# Altium schematic sheet LAN_RJ45.SchDoc
size B; SheetNumber: 4; SheetTotal: 4
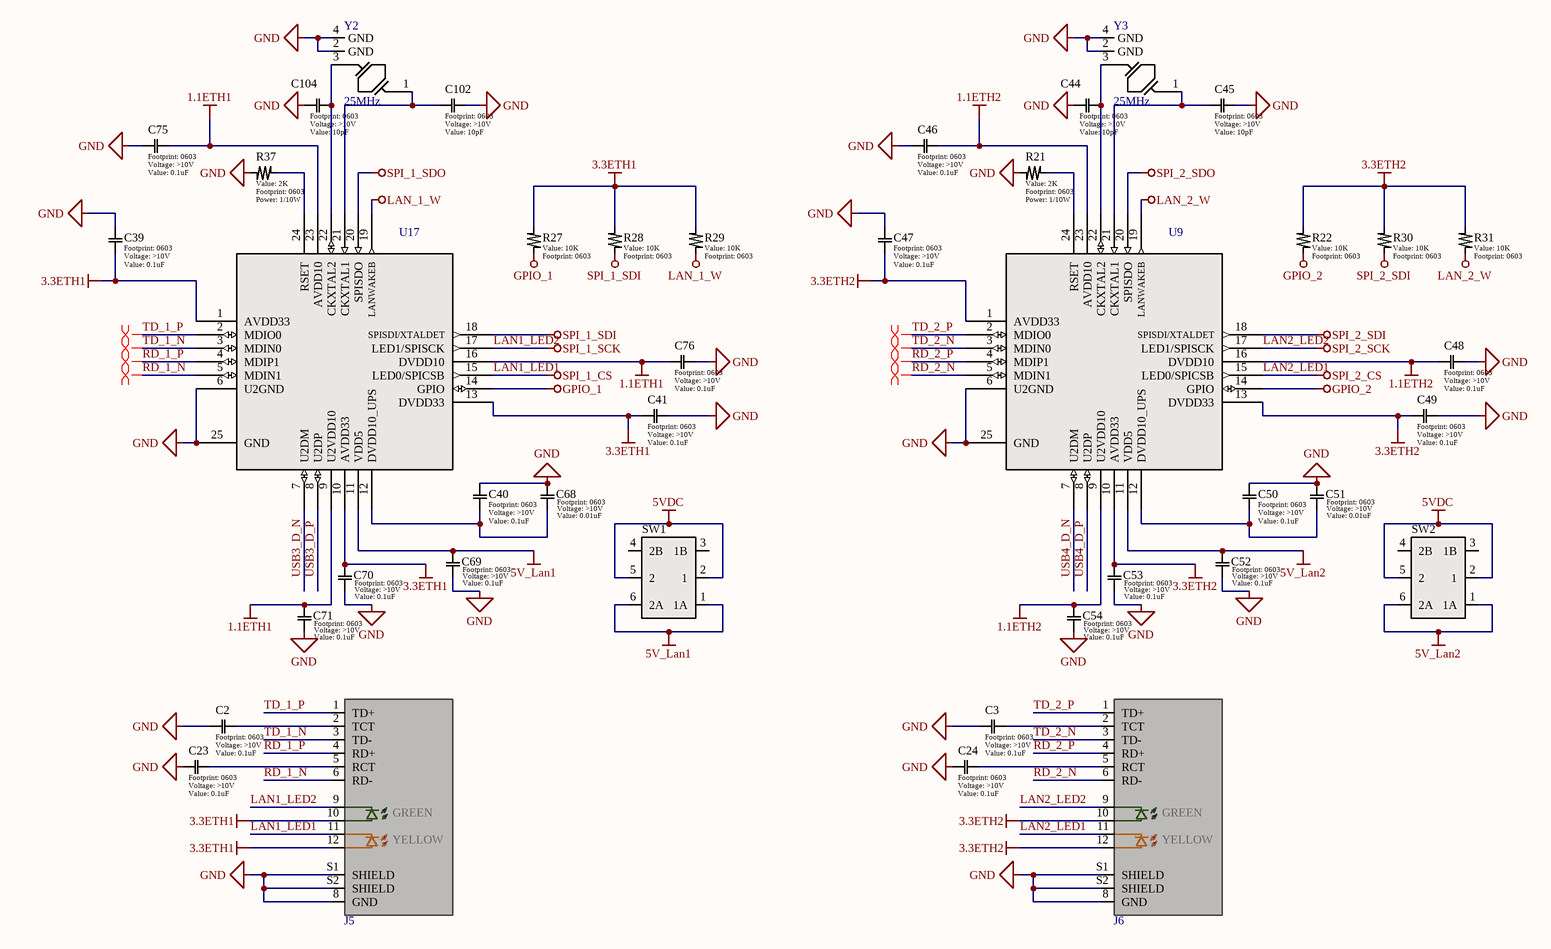
[diagram p0: LAN_RJ45.SchDoc]

## Parts
C2  value 0.1uF  Voltage: >10V  [0603]  (hidden comment: Generic Capacitor)
C3  value 0.1uF  Voltage: >10V  [0603]  (hidden comment: Generic Capacitor)
C23  value 0.1uF  Voltage: >10V  [0603]  (hidden comment: Generic Capacitor)
C24  value 0.1uF  Voltage: >10V  [0603]  (hidden comment: Generic Capacitor)
C39  value 0.1uF  Voltage: >10V  [0603]  (hidden comment: Generic Capacitor)
C40  value 0.1uF  Voltage: >10V  [0603]  (hidden comment: Generic Capacitor)
C41  value 0.1uF  Voltage: >10V  [0603]  (hidden comment: Generic Capacitor)
C44  value 10pF  Voltage: >10V  [0603]  (hidden comment: Generic Capacitor)
C45  value 10pF  Voltage: >10V  [0603]  (hidden comment: Generic Capacitor)
C46  value 0.1uF  Voltage: >10V  [0603]  (hidden comment: Generic Capacitor)
C47  value 0.1uF  Voltage: >10V  [0603]  (hidden comment: Generic Capacitor)
C48  value 0.1uF  Voltage: >10V  [0603]  (hidden comment: Generic Capacitor)
C49  value 0.1uF  Voltage: >10V  [0603]  (hidden comment: Generic Capacitor)
C50  value 0.1uF  Voltage: >10V  [0603]  (hidden comment: Generic Capacitor)
C51  value 0.01uF  Voltage: >10V  [0603]  (hidden comment: Generic Capacitor)
C52  value 0.1uF  Voltage: >10V  [0603]  (hidden comment: Generic Capacitor)
C53  value 0.1uF  Voltage: >10V  [0603]  (hidden comment: Generic Capacitor)
C54  value 0.1uF  Voltage: >10V  [0603]  (hidden comment: Generic Capacitor)
C68  value 0.01uF  Voltage: >10V  [0603]  (hidden comment: Generic Capacitor)
C69  value 0.1uF  Voltage: >10V  [0603]  (hidden comment: Generic Capacitor)
C70  value 0.1uF  Voltage: >10V  [0603]  (hidden comment: Generic Capacitor)
C71  value 0.1uF  Voltage: >10V  [0603]  (hidden comment: Generic Capacitor)
C75  value 0.1uF  Voltage: >10V  [0603]  (hidden comment: Generic Capacitor)
C76  value 0.1uF  Voltage: >10V  [0603]  (hidden comment: Generic Capacitor)
C102  value 10pF  Voltage: >10V  [0603]  (hidden comment: Generic Capacitor)
C104  value 10pF  Voltage: >10V  [0603]  (hidden comment: Generic Capacitor)
J5  V-RJ45-100  [BEL_SI-46001-F]  (value not drawn)
J6  V-RJ45-100  [BEL_SI-46001-F]  (value not drawn)
R21  value 2K  Power: 1/10W  [0603]  (hidden comment: Generic Resistor)
R22  value 10K  [0603]  (hidden comment: Generic Resistor)
R27  value 10K  [0603]  (hidden comment: Generic Resistor)
R28  value 10K  [0603]  (hidden comment: Generic Resistor)
R29  value 10K  [0603]  (hidden comment: Generic Resistor)
R30  value 10K  [0603]  (hidden comment: Generic Resistor)
R31  value 10K  [0603]  (hidden comment: Generic Resistor)
R37  value 2K  Power: 1/10W  [0603]  (hidden comment: Generic Resistor)
SW1  (no value)  [SMD-DPDT-SW]
SW2  (no value)  [SMD-DPDT-SW]
U9  10/100 USB LAN  [RTL8152B-VB-CG]  (value not drawn)
U17  10/100 USB LAN  [RTL8152B-VB-CG]  (value not drawn)
Y2  25MHz  [SMD3225-4P]
Y3  25MHz  [SMD3225-4P]

## Nets
1.1ETH1: C71.1 C75.1 C76.2 U17.9(U2VDD10) U17.16(DVDD10) U17.23(AVDD10)
1.1ETH2: C46.1 C48.2 C54.1 U9.9(U2VDD10) U9.16(DVDD10) U9.23(AVDD10)
3.3ETH1: C39.1 C41.2 C70.1 J5.10(GA) J5.12(YA) R27.1 R28.1 R29.1 U17.1(AVDD33) U17.10(AVDD33) U17.13(DVDD33)
3.3ETH2: C47.1 C49.2 C53.1 J6.10(GA) J6.12(YA) R22.1 R30.1 R31.1 U9.1(AVDD33) U9.10(AVDD33) U9.13(DVDD33)
5V_Lan1: C69.1 SW1.1(1A) SW1.6(2A) U17.11(VDD5)
5V_Lan2: C52.1 SW2.1(1A) SW2.6(2A) U9.11(VDD5)
5VDC: SW1.2(1) SW1.5(2) SW2.2(1) SW2.5(2)
GND: C2.1 C3.1 C23.1 C24.1 C39.2 C40.1 C41.1 C44.2 C45.1 C46.2 C47.2 C48.1 C49.1 C50.1 C51.1 C52.2 C53.2 C54.2 C68.1 C69.2 C70.2 C71.2 C75.2 C76.1 C102.1 C104.2 J5.8(GND) J5.S1(SHIELD) J5.S2(SHIELD) J6.8(GND) J6.S1(SHIELD) J6.S2(SHIELD) R21.1 R37.1 U9.6(U2GND) U9.25(GND) U17.6(U2GND) U17.25(GND) Y2.2(GND) Y2.4(GND) Y3.2(GND) Y3.4(GND)
GPIO_1: R27.2 U17.14(GPIO)
GPIO_2: R22.2 U9.14(GPIO)
LAN1_LED1: J5.11(YK) U17.15(LED0/SPICSB)  [also labelled SPI_1_CS]
LAN1_LED2: J5.9(GK) U17.17(LED1/SPISCK)  [also labelled SPI_1_SCK]
LAN2_LED1: J6.11(YK) U9.15(LED0/SPICSB)  [also labelled SPI_2_CS]
LAN2_LED2: J6.9(GK) U9.17(LED1/SPISCK)  [also labelled SPI_2_SCK]
LAN_1_W: R29.2 U17.19(LANWAKEB)
LAN_2_W: R31.2 U9.19(LANWAKEB)
SPI_1_SDI: R28.2 U17.18(SPISDI/XTALDET)
SPI_1_SDO: U17.20(SPISDO)
SPI_2_SDI: R30.2 U9.18(SPISDI/XTALDET)
SPI_2_SDO: U9.20(SPISDO)
RD_1_N: J5.6(RD-) U17.5(MDIN1)
RD_1_P: J5.4(RD+) U17.4(MDIP1)
RD_2_N: J6.6(RD-) U9.5(MDIN1)
RD_2_P: J6.4(RD+) U9.4(MDIP1)
TD_1_N: J5.3(TD-) U17.3(MDIN0)
TD_1_P: J5.1(TD+) U17.2(MDIO0)
TD_2_N: J6.3(TD-) U9.3(MDIN0)
TD_2_P: J6.1(TD+) U9.2(MDIO0)
USB3_D_N: U17.7(U2DM)
USB3_D_P: U17.8(U2DP)
USB4_D_N: U9.7(U2DM)
USB4_D_P: U9.8(U2DP)
NetC2_2: C2.2 J5.2(TCT)
NetC3_2: C3.2 J6.2(TCT)
NetC23_2: C23.2 J5.5(RCT)
NetC24_2: C24.2 J6.5(RCT)
NetC40_2: C40.2 C68.2 U17.12(DVDD10_UPS)
NetC44_1: C44.1 U9.22(CKXTAL2) Y3.3
NetC45_2: C45.2 U9.21(CKXTAL1) Y3.1
NetC50_2: C50.2 C51.2 U9.12(DVDD10_UPS)
NetC102_2: C102.2 U17.21(CKXTAL1) Y2.1
NetC104_1: C104.1 U17.22(CKXTAL2) Y2.3
NetR21_2: R21.2 U9.24(RSET)
NetR37_2: R37.2 U17.24(RSET)

Not connected (* = marked no-connect by the designer): SW1 3(1B) 4(2B); SW2 3(1B) 4(2B)

## Layout directives
differential pair: RD_1_N, RD_1_P, RD_2_N, RD_2_P, TD_1_N, TD_1_P, TD_2_N, TD_2_P

## Notes on the sheet
- REV
- REVISIONS
- DATE
- DESCRIPTION
- BY
- UNLESS OTHERWISE SPECIFIED, DRAWING DEFINITIONS AND TOLERANCES SHALL BE FOUND UNDER SUPPLIER STANDARDS SS-001. THIS PART AND ALL COMPONENTS OF IT MUST BE RoHS & REACH COMPLIANT. A CERTIFICATE OF COMPLIANCE MUST BE PROVIDED UPON REQUEST.
- ALL INFORMATION ON THIS DOCUMENT IS THE SOLE PROPERTY OF GAMBER-JOHNSON AND SHALL NOT BE COPIED, REPRODUCED, USED OR DISCLOSED IN WHOLE OR IN PART WITHOUT THE WRITTEN CONSENT OF GAMBER-JOHNSON
- TOLERANCES
  .00 ± .060
  .000 ± .020
  .0000 ± .005
  ANGELS ± 1°
- DRAWN BY:
- PROJECT NUMBER:
- SHEET TITLE:
- SHEET
- OF
- DATE:
- LOCATION:
- ASSEMBLY NUMBER
- SIZE
- GAMBER-JOHNSON LLC
  5001 JOERNS DR.
  STEVENS POINT, WI 54481
  +1 (715) 344-5209
- B
- (in symbol SI-46001-F) GREEN; YELLOW

## Library data of the parts
C2 C3 C23 C24 C39-C41 C44-C54 C68-C71 C75 C76 C102 C104 = Generic Capacitor: Tolerance: 10%
J5 J6 = SI-46001-F: Conn RJ-45 F 8 POS 2.54mm Solder ST Thru-Hole 12 Terminal 1 Port; MF: Bel Magnetic Solutions; DigiKey-Purchase-URL: https://snapeda.com/shop?store=DigiKey&id=4791083; Mouser-Purchase-URL: https://snapeda.com/shop?store=Mouser&id=4791083; Value: *; MP: SI-46001-F; Availability: Unavailable; Price: None; Package: None; SnapEDA_Link: https://www.snapeda.com/parts/SI-46001-F/Bel%20Magnetic%20Solutions/view-part/4791083/?ref=snap; LCSC PN: C2760326
R21 R37 = Generic Resistor: Tolerance: 1%
R22 R27-R31 = Generic Resistor: Tolerance: 1%; Power: 1/10W
SW1 SW2 = MS-22D17-G2: Brick nogging DPDT Black SMD Slide Switch; LCSC PN: C2904912
U9 U17 = RTL8152B-VB-CG: Ethernet Controllers 1V ~ 5.25V IEEE 802.3, USB 2.0, USB 1.1 MII, SPI, USB QFN-24_4x4x05P Ethernet ICs ROHS; LCSC PN: C50656
Y2 Y3 = ABM8G-25.000MHZ-B4Y-T: 25 MHz ±30ppm Crystal 10pF 60 Ohms 4-SMD, No Lead / SMD3225-4P; Manufacturer: Abracon; ESR (Equivalent Series Resistance): 60R; Supplier 1: Digi-Key; Supplier Part Number 1: 535-10297-1-ND; Manufacturer Part Number: ABM8G-25.000MHZ-B4Y-T; RoHS: Yes; Category: Crystals; Stock 1: 123; Pricing 1: 1=0.82000, 10=0.72900, 50=0.68120, 100=0.60190, 500=0.57024 (USD); Mount: Surface Mount; Case/Package: SMD/SMT; Number of Pins: 4; Min Operating Temperature: -20°C; Max Operating Temperature: 70°C; Packaging: Tape and Reel; Frequency Tolerance: 30ppm; Load Capacitance: 10pF; Frequency: 25MHz; Package Quantity: 1000; Tolerance: 30ppm; Frequency Stability: 30ppm; Termination: SMD/SMT; Series: ABM8G; Series Resistance: 60R; Operating Frequency: 25 MHz; Length: 3.2mm; Width: 0.098inch; Height: 0.039inch; Depth: 2.5mm; REACH SVHC: Unknown; Lead Free: Lead Free; ComponentLink1URL: https://datasheet.ciiva.com/855/abm8g-855228.pdf?src-supplier=Digi-Key; ComponentLink1Description: https://datasheet.ciiva.com/855/abm8g-855228.pdf?src-supplier=Digi-Key; ComponentLink2URL: https://datasheet.ciiva.com/855/abm8g-855229.pdf?src-supplier=Digi-Key; ComponentLink2Description: https://datasheet.ciiva.com/855/abm8g-855229.pdf?src-supplier=Digi-Key; ComponentLink3URL: https://datasheet.ciiva.com/855/abm8g-855230.pdf?src-supplier=Digi-Key; ComponentLink3Description: https://datasheet.ciiva.com/855/abm8g-855230.pdf?src-supplier=Digi-Key; ComponentLink4URL: https://datasheet.ciiva.com/4945/abm8g-10572-4945134.pdf?src-supplier=Mouser; ComponentLink4Description: https://datasheet.ciiva.com/4945/abm8g-10572-4945134.pdf?src-supplier=Mouser; ComponentLink5URL: https://datasheet.ciiva.com/7998/abm8g-7998635.pdf?src-supplier=Element14; ComponentLink5Description: https://datasheet.ciiva.com/7998/abm8g-7998635.pdf?src-supplier=Element14; ComponentLink6URL: https://datasheet.ciiva.com/28508/1883677-28508586.pdf?src-supplier=Element14; ComponentLink6Description: https://datasheet.ciiva.com/28508/1883677-28508586.pdf?src-supplier=Element14; ComponentLink7URL: https://datasheet.ciiva.com/16416/abm8g-16416874.pdf?src-supplier=Future+Electronics; ComponentLink7Description: https://datasheet.ciiva.com/16416/abm8g-16416874.pdf?src-supplier=Future+Electronics; LCSC PN: C9006